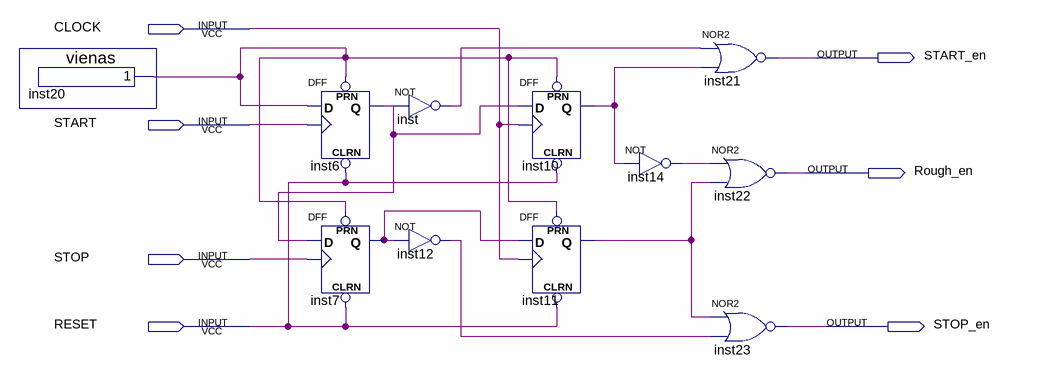
[diagram p0: schematic sheet]
// Quartus schematic start_stop.bdf as structural Verilog: 11 symbols, 7 pins
module start_stop (
  input  CLOCK,
  input  START,
  input  STOP,
  input  RESET,
  output START_en,
  output Rough_en,
  output STOP_en
);

  wire inst6_q, inst7_q, inst10_q, inst11_q, inst12_out, inst14_out, inst20_result, inst_out;

  vienas inst20 (.result(inst20_result));
  DFF inst6 (.CLRN(RESET), .CLK(START), .D(inst20_result), .PRN(inst20_result), .Q(inst6_q));
  DFF inst7 (.CLRN(RESET), .CLK(STOP), .D(inst6_q), .PRN(inst20_result), .Q(inst7_q));
  not inst (inst_out, inst6_q);
  not inst12 (inst12_out, inst7_q);
  DFF inst10 (.CLRN(RESET), .CLK(CLOCK), .D(inst6_q), .PRN(inst20_result), .Q(inst10_q));
  DFF inst11 (.CLRN(RESET), .CLK(CLOCK), .D(inst7_q), .PRN(inst20_result), .Q(inst11_q));
  not inst14 (inst14_out, inst10_q);
  nor inst21 (START_en, inst_out, inst10_q);
  nor inst22 (Rough_en, inst14_out, inst11_q);
  nor inst23 (STOP_en, inst11_q, inst12_out);
endmodule
